# Altium schematic sheet OutputConn.SchDoc
size A; SheetNumber: 3; SheetTotal: 4
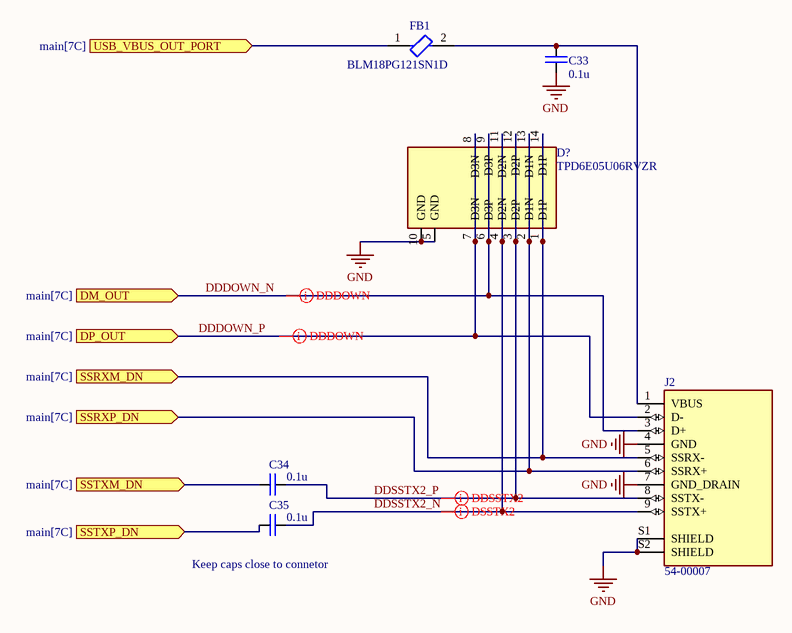
[diagram p0: OutputConn.SchDoc]

## Parts
C33  value 0.1u  [CAP_0603_N]  (hidden comment: comment)
C34  value 0.1u  [CAP_0603_N]  (hidden comment: comment)
C35  value 0.1u  [CAP_0603_N]  (hidden comment: comment)
D?  TPD6E05U06RVZR  [SON50P135X350X55-14N]
FB1  BLM18PG121SN1D  [FP-BLM18-0_15-t0_8-IPC_B]
J2  54-00007  [TENSILITY_54-00007]

## Ports
DM_OUT (in, see main[7C]), DP_OUT (in, see main[7C]), SSRXM_DN (in, see main[7C]), SSRXP_DN (in, see main[7C]), SSTXM_DN (in, see main[7C]), SSTXP_DN (in, see main[7C]), USB_VBUS_OUT_PORT (in, see main[7C])

## Nets
GND: C33.1 D?.5(GND) D?.10(GND) J2.4(GND) J2.7(GND_DRAIN) J2.S1(SHIELD) J2.S2(SHIELD)
DDDOWN_N: D?.6(D3P) D?.9(D3P) J2.3(D+) ; port DM_OUT
DDDOWN_P: D?.7(D3N) D?.8(D3N) J2.2(D-) ; port DP_OUT
DDSSTX2_N: C35.2 D?.4(D2N) D?.11(D2N) J2.9(SSTX+)
DDSSTX2_P: C34.2 D?.3(D2P) D?.12(D2P) J2.8(SSTX-)
SSRXM_DN: D?.1(D1P) D?.14(D1P) J2.5(SSRX-) ; port SSRXM_DN
SSRXP_DN: D?.2(D1N) D?.13(D1N) J2.6(SSRX+) ; port SSRXP_DN
SSTXM_DN: C34.1 ; port SSTXM_DN
SSTXP_DN: C35.1 ; port SSTXP_DN
USB_VBUS_OUT_PORT: FB1.1 ; port USB_VBUS_OUT_PORT
NetC33_2: C33.2 FB1.2 J2.1(VBUS)

## Layout directives
differential pair: DDDOWN_N, DDDOWN_P, DDSSTX2_N, DDSSTX2_P

## Notes on the sheet
- (near C35) Keep caps close to connetor

## Library data of the parts
C33-C35 = Capacitor non-polarized
D? = TPD6E05U06RVZR: 6-Channel Ultra low capacitance IEC ESD protection diodes 14-USON -40 to 125; MP: TPD6E05U06RVZR; Price: None; Package: None; Value: *; Availability: Unavailable
FB1 = CMP-0686-00557-7: Chip Ferrite Bead, 0603, 120Ω @ 100MHz, 0.05Ω, 25%, 2A; Impedance: 120R; Number of Circuits: 1; Shielding: Unshielded; Material: Steel; DC Resistance (DCR): 50mR; Case Code (Imperial): 0603; RoHS Compliant: Yes; Number of Pins: 2; Min Operating Temperature: -55°C; Case Code (Metric): 1608; Frequency: 100MHz; Length: 1.6mm; Test Frequency: 100MHz; Max Operating Temperature: 125°C; Packaging: Tape and Reel; Max Current Rating: 2A; Termination: SMD/SMT; Lead Free: Lead Free; Max DC Current: 2A; Case/Package: 0603; Height: 0.8mm; Current Rating: 2A; Radiation Hardening: No; Core Material: Ferrite; DC Current: 2A; REACH SVHC: No SVHC; Package Quantity: 1; Depth: 0.8mm; Number of Lines: 1; Tolerance: 25%; Width: 0.8mm
J2 = 54-00007: Connector, USB A 3.0 Jack, PCB mount, 90 degrees, nickel shell, DIP, board lock, blue insulator, tray; MF: Tensility International Corp; SnapEDA_Link: https://www.snapeda.com/parts/54-00007/Tensility+International+Corp/view-part/?ref=snap; Package: None; Value: *; MP: 54-00007; Check_prices: https://www.snapeda.com/parts/54-00007/Tensility+International+Corp/view-part/?ref=eda